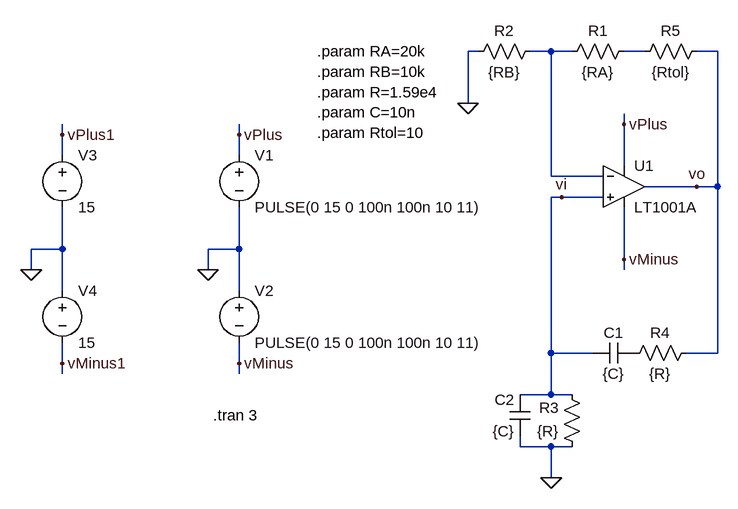
[diagram p0: schematic WienBridge.asc]
WienBridge.asc, the LTspice schematic file:
Version 4
SHEET 1 880 680
WIRE 48 -128 32 -128
WIRE 160 -128 128 -128
WIRE 192 -128 160 -128
WIRE 304 -128 272 -128
WIRE 416 -128 384 -128
WIRE 32 -48 32 -128
WIRE 272 -16 272 -32
WIRE -592 0 -592 -16
WIRE -320 0 -320 -16
WIRE -592 32 -592 0
WIRE -320 32 -320 0
WIRE 272 48 272 -16
WIRE 160 64 160 -128
WIRE 240 64 160 64
WIRE 384 80 304 80
WIRE 416 80 416 -128
WIRE 416 80 384 80
WIRE 176 96 160 96
WIRE 240 96 176 96
WIRE -592 176 -592 112
WIRE -592 176 -640 176
WIRE -320 176 -320 112
WIRE -320 176 -368 176
WIRE 272 192 272 112
WIRE -640 208 -640 176
WIRE -368 208 -368 176
WIRE 272 208 272 192
WIRE -592 240 -592 176
WIRE -320 240 -320 176
WIRE 160 336 160 96
WIRE 224 336 160 336
WIRE 416 336 416 80
WIRE 416 336 368 336
WIRE -592 352 -592 320
WIRE -320 352 -320 320
WIRE -592 368 -592 352
WIRE -320 368 -320 352
WIRE 160 400 160 336
WIRE 160 400 112 400
WIRE 192 400 160 400
WIRE 112 480 112 464
WIRE 160 480 112 480
WIRE 192 480 160 480
WIRE 160 528 160 480
FLAG 32 -48 0
FLAG -368 208 0
FLAG -320 0 vPlus
FLAG -320 352 vMinus
FLAG 272 -16 vPlus
FLAG 272 192 vMinus
FLAG 384 80 vo
FLAG 176 96 vi
FLAG 160 528 0
FLAG -640 208 0
FLAG -592 0 vPlus1
FLAG -592 352 vMinus1
SYMBOL Opamps\\LT1001A 272 16 R0
SYMATTR InstName U1
SYMBOL voltage -320 16 R0
WINDOW 123 0 0 Left 2
WINDOW 39 0 0 Left 2
SYMATTR InstName V1
SYMATTR Value PULSE(0 15 0 100n 100n 10 11)
SYMBOL voltage -320 224 R0
WINDOW 123 0 0 Left 2
WINDOW 39 0 0 Left 2
SYMATTR InstName V2
SYMATTR Value PULSE(0 15 0 100n 100n 10 11)
SYMBOL res 288 -144 R90
WINDOW 0 0 56 VBottom 2
WINDOW 3 32 56 VTop 2
SYMATTR InstName R1
SYMATTR Value {RA}
SYMBOL res 144 -144 R90
WINDOW 0 0 56 VBottom 2
WINDOW 3 32 56 VTop 2
SYMATTR InstName R2
SYMATTR Value {RB}
SYMBOL res 208 496 R180
WINDOW 0 36 76 Left 2
WINDOW 3 36 40 Left 2
SYMATTR InstName R3
SYMATTR Value {R}
SYMBOL res 384 320 R90
WINDOW 0 0 56 VBottom 2
WINDOW 3 32 56 VTop 2
SYMATTR InstName R4
SYMATTR Value {R}
SYMBOL cap 288 320 R90
WINDOW 0 0 32 VBottom 2
WINDOW 3 32 32 VTop 2
SYMATTR InstName C1
SYMATTR Value {C}
SYMBOL cap 128 464 R180
WINDOW 0 24 56 Left 2
WINDOW 3 24 8 Left 2
SYMATTR InstName C2
SYMATTR Value {C}
SYMBOL res 400 -144 R90
WINDOW 0 0 56 VBottom 2
WINDOW 3 32 56 VTop 2
SYMATTR InstName R5
SYMATTR Value {Rtol}
SYMBOL voltage -592 16 R0
WINDOW 123 0 0 Left 2
WINDOW 39 0 0 Left 2
SYMATTR InstName V3
SYMATTR Value 15
SYMBOL voltage -592 224 R0
WINDOW 123 0 0 Left 2
WINDOW 39 0 0 Left 2
SYMATTR InstName V4
SYMATTR Value 15
TEXT -360 432 Left 2 !.tran 3
TEXT -200 -128 Left 2 !.param RA=20k\n.param RB=10k\n.param R=1.59e4\n.param C=10n\n.param Rtol=10

The netlist it stands for:
* WienBridge.asc
XU1 vi N001 vPlus vMinus vo LT1001  ; LT1001A, pins In+ In- V+ V- OUT
V1 vPlus 0 PULSE(0 15 0 100n 100n 10 11)
V2 0 vMinus PULSE(0 15 0 100n 100n 10 11)
R1 N002 N001 {RA}
R2 N001 0 {RB}
R3 0 vi {R}
R4 vo P001 {R}
C1 P001 vi {C}
C2 0 vi {C}
R5 vo N002 {Rtol}
V3 vPlus1 0 15
V4 0 vMinus1 15
.tran 3
.param RA=20k
.param RB=10k
.param R=1.59e4
.param C=10n
.param Rtol=10
.lib LTC.lib
.backanno
.end